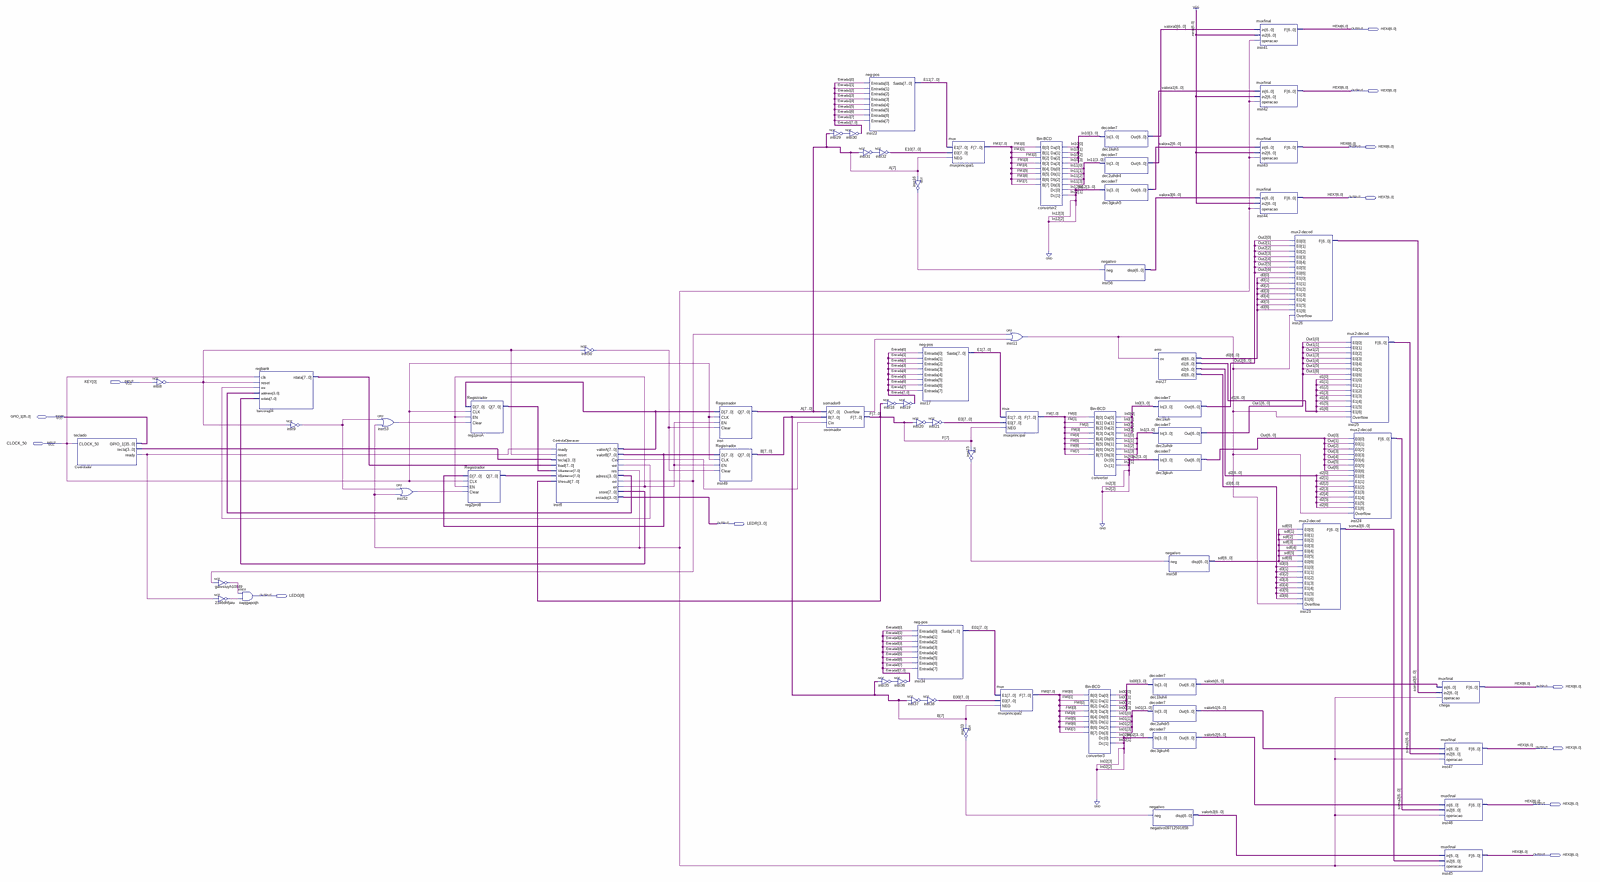
[diagram p0: schematic sheet, whole]
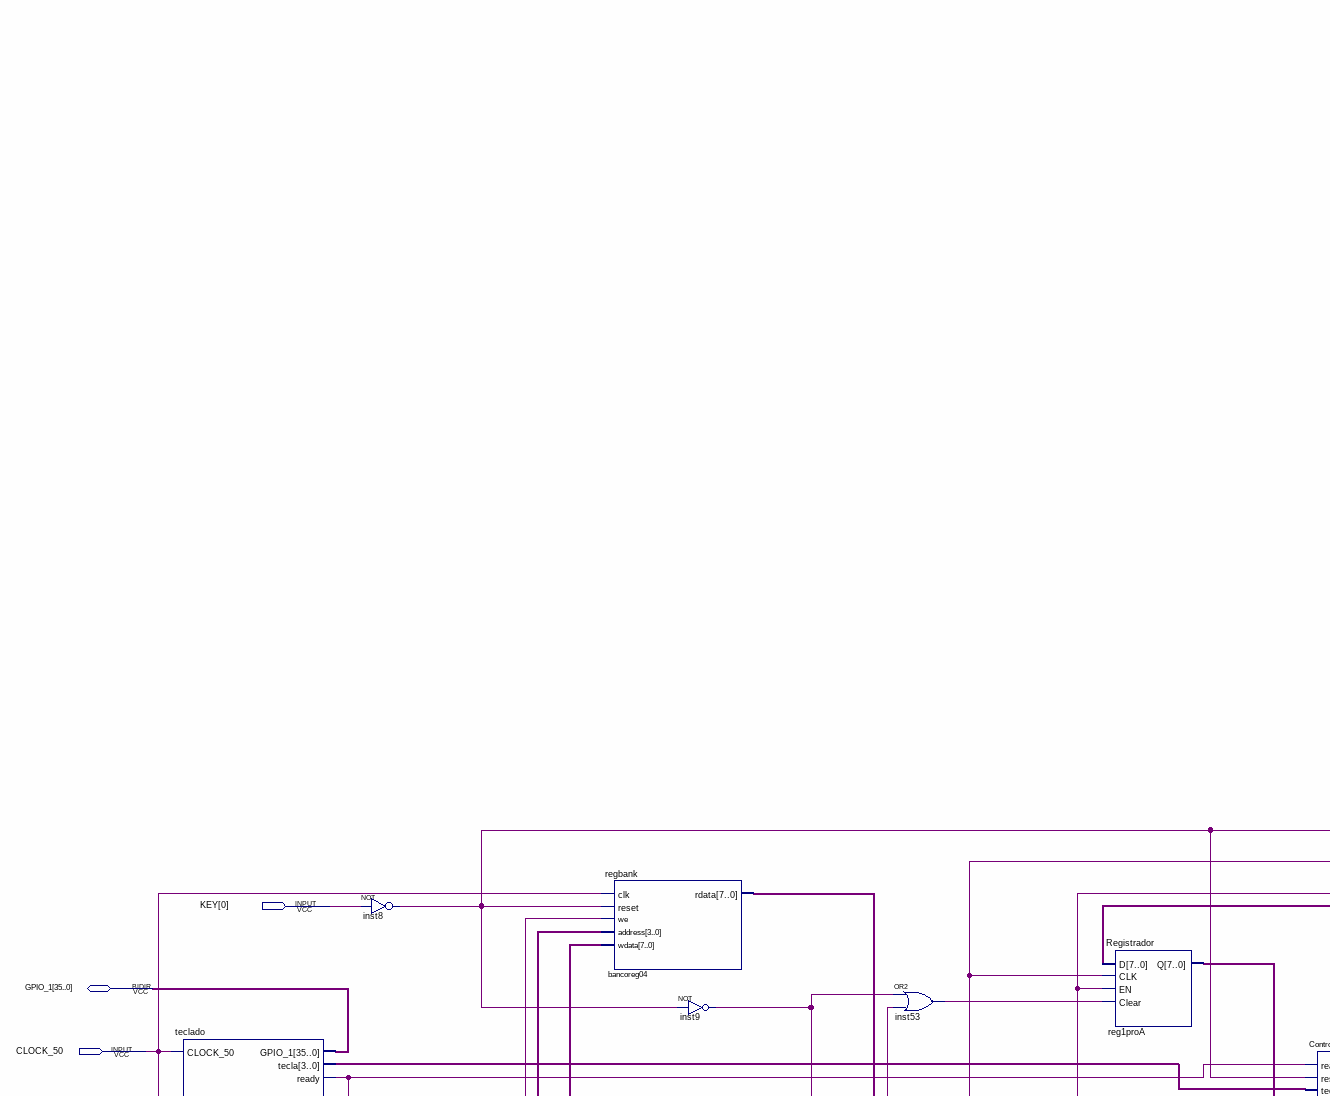
[diagram p1: schematic sheet, upper left part]
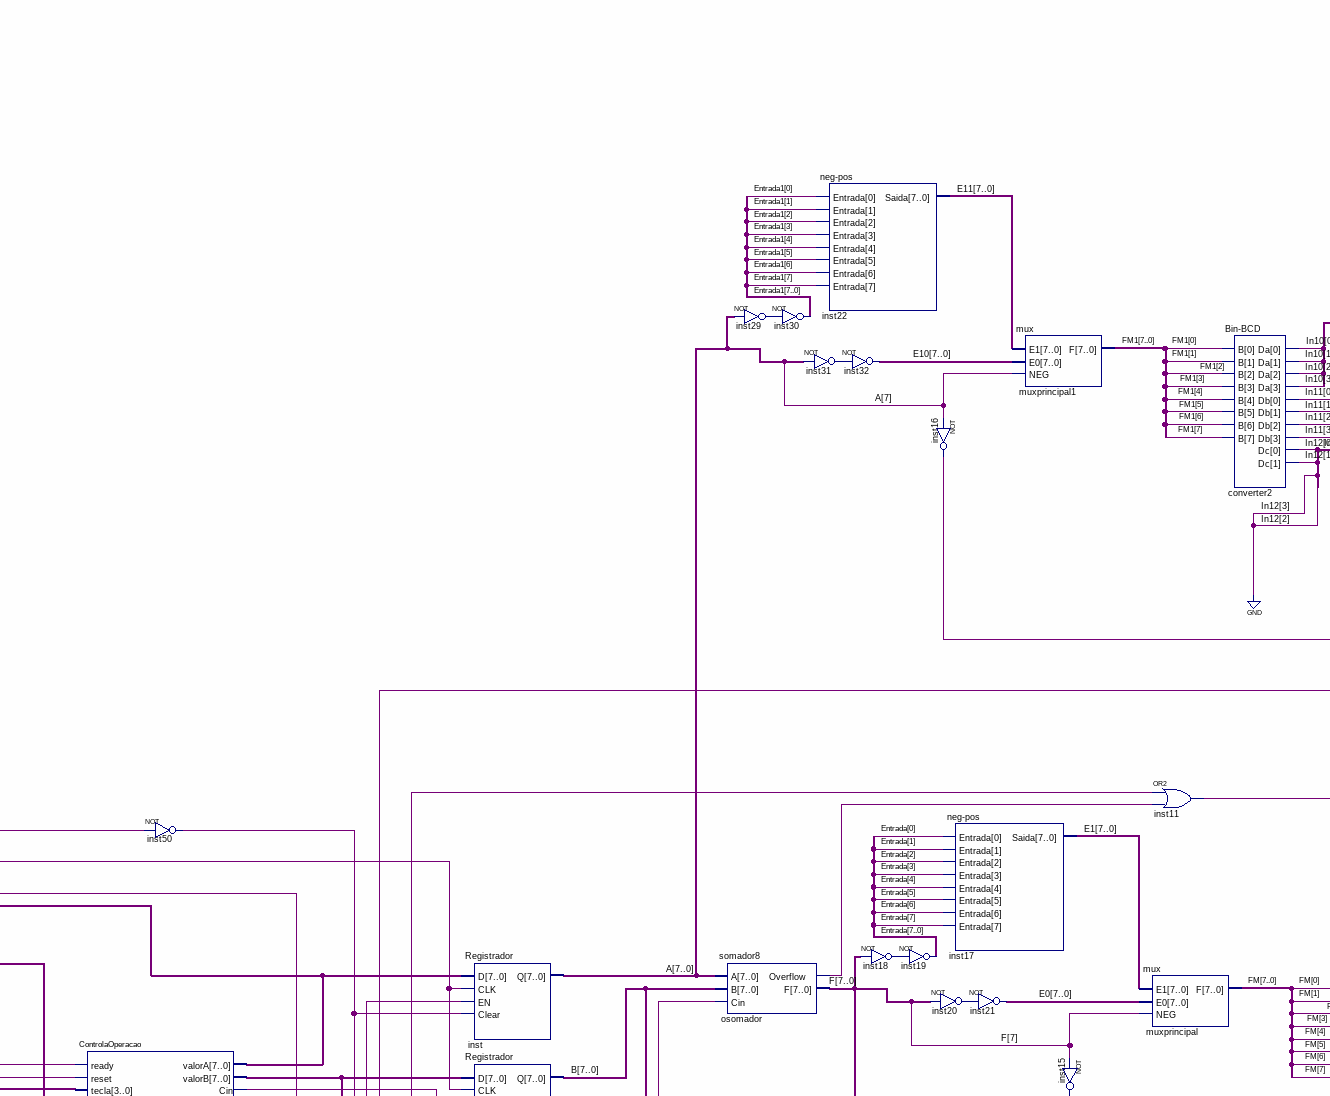
[diagram p2: schematic sheet, upper centre part]
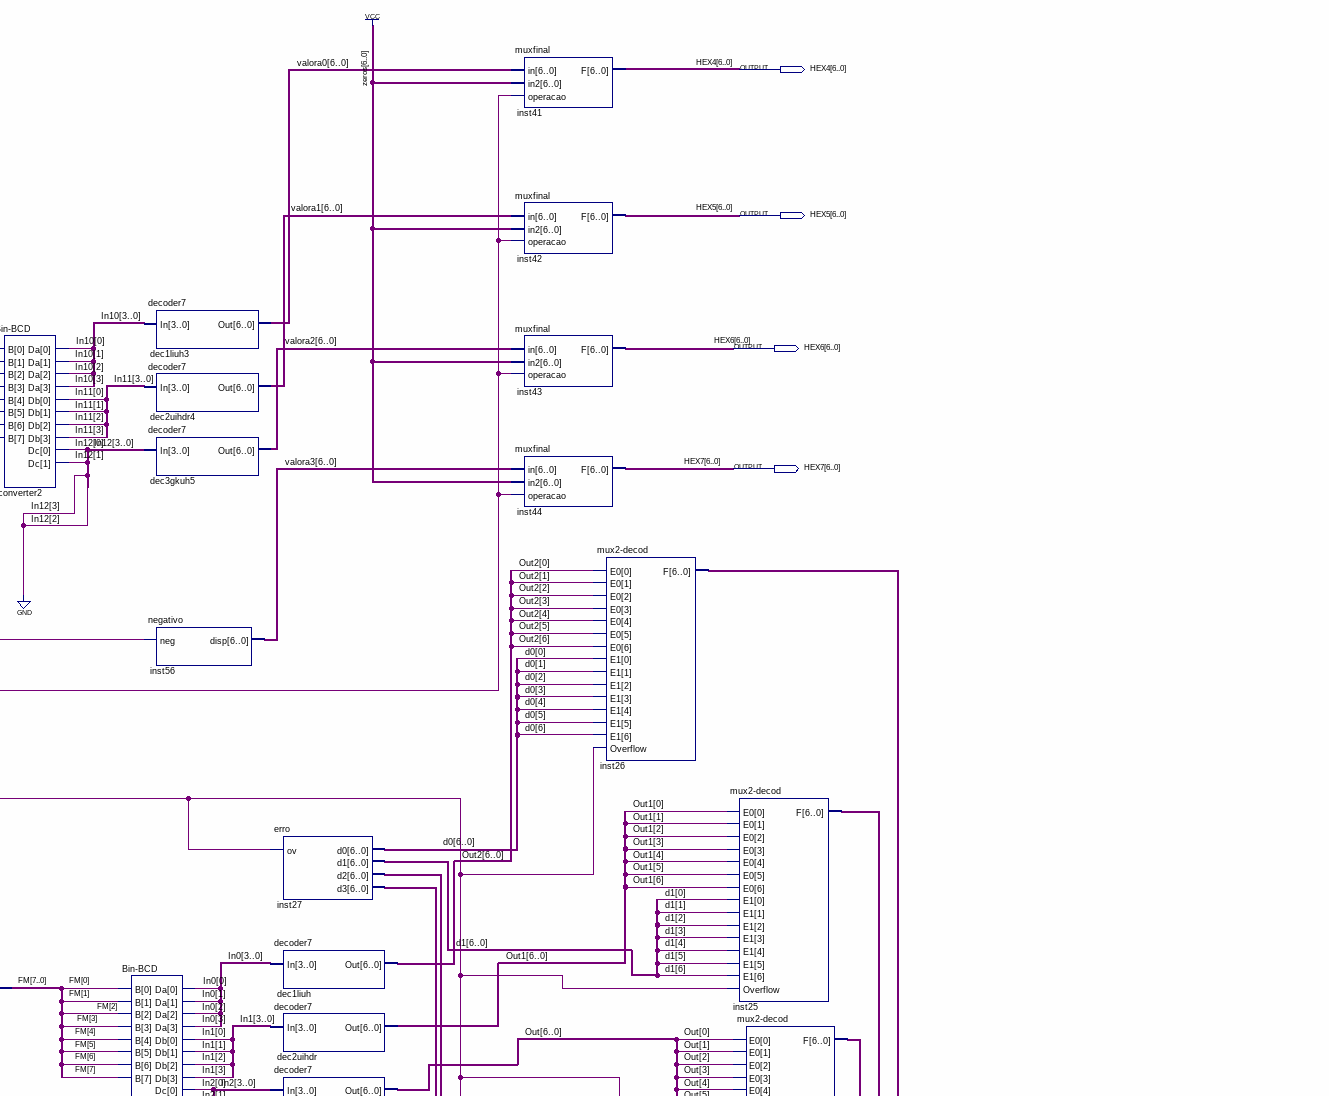
[diagram p3: schematic sheet, upper right part]
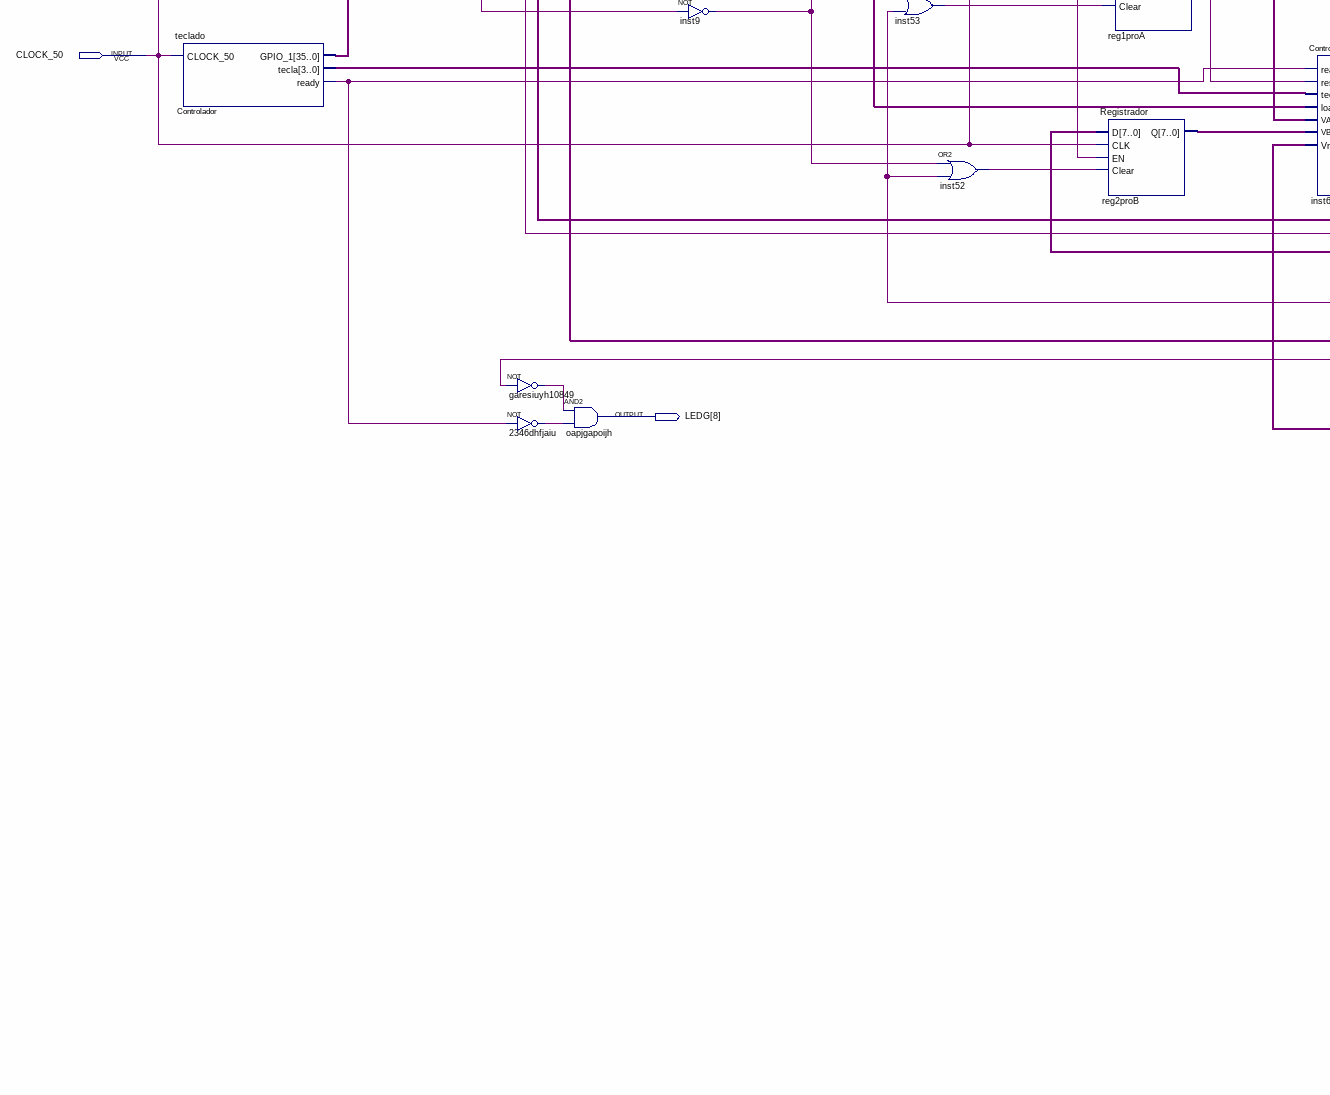
[diagram p4: schematic sheet, lower left part]
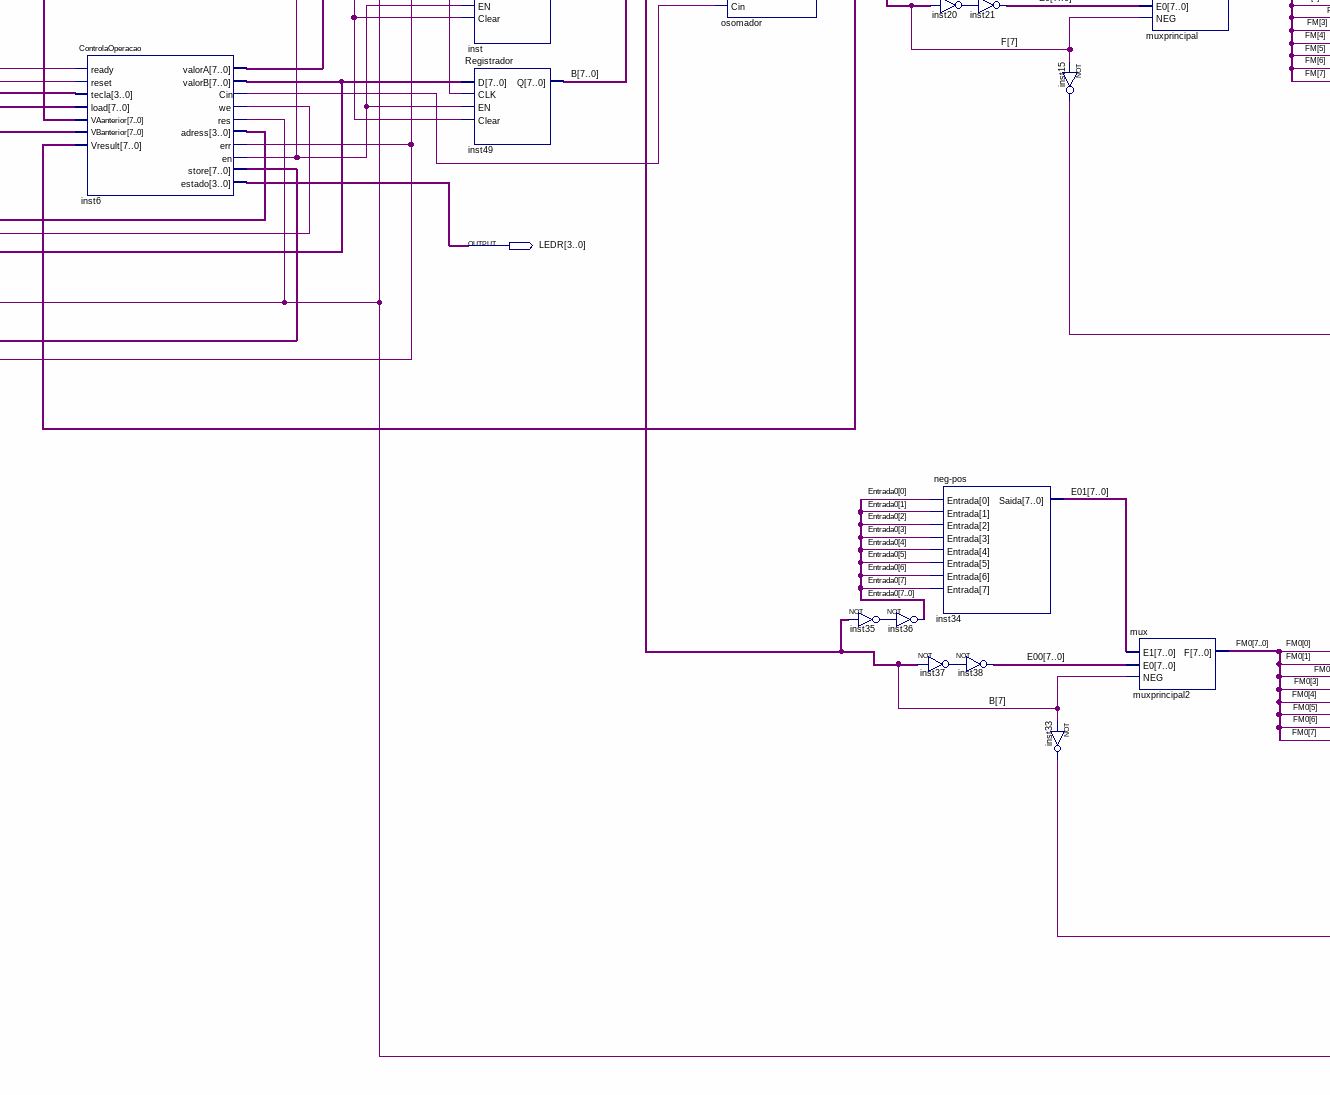
[diagram p5: schematic sheet, lower centre part]
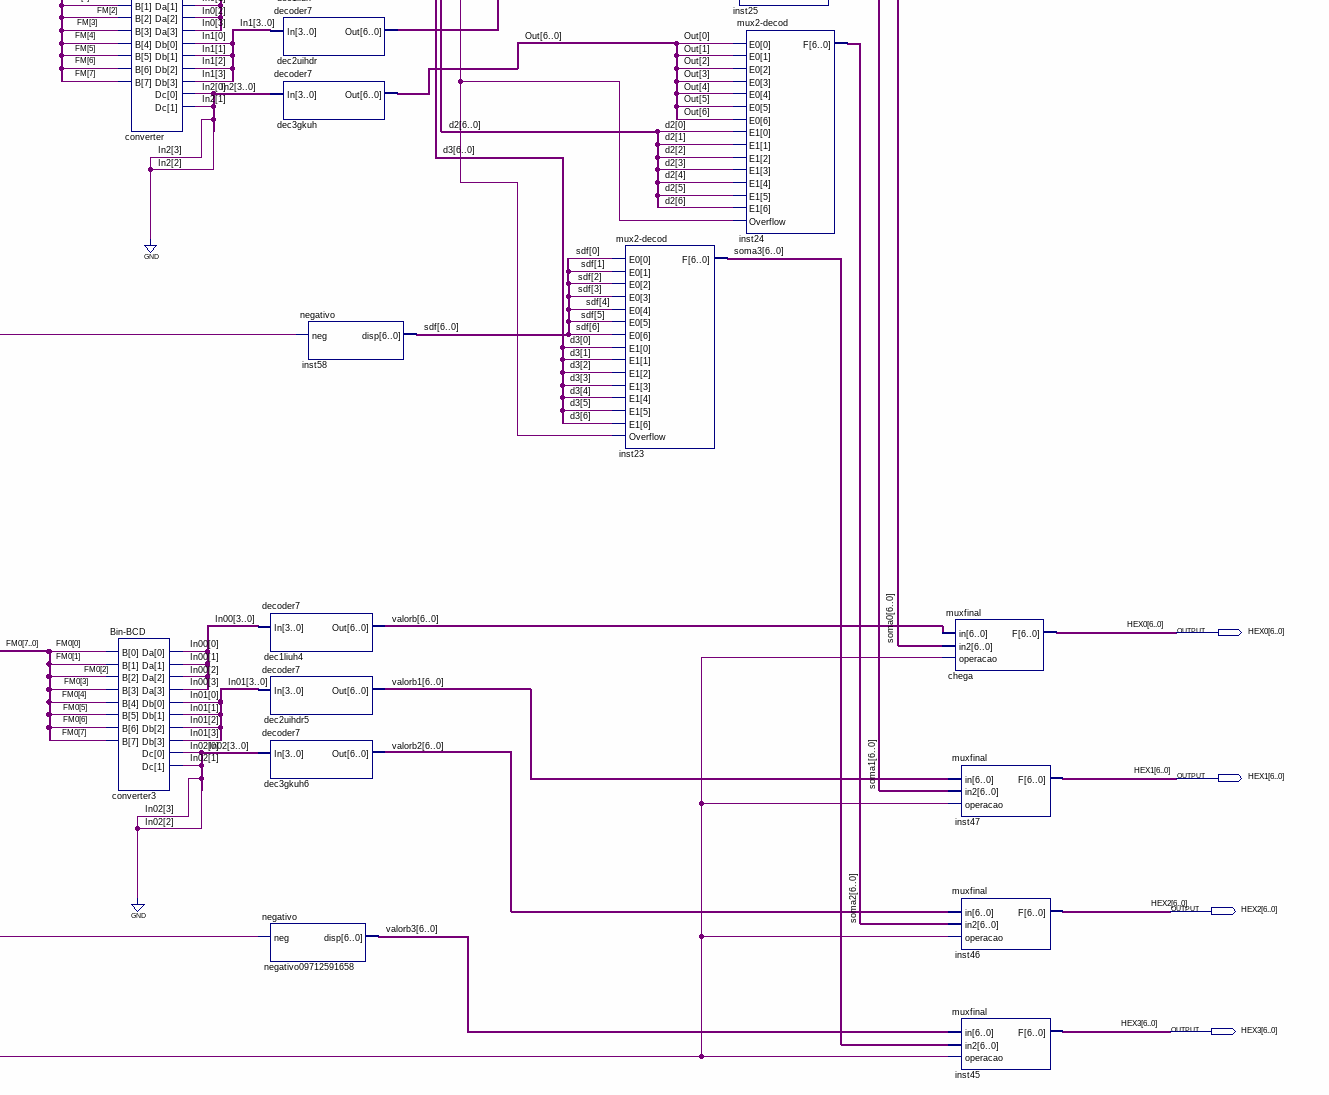
[diagram p6: schematic sheet, lower right part]
// Quartus schematic proj.bdf as structural Verilog: 66 symbols, 13 pins
module proj (
  input  [0:0] KEY,
  input  CLOCK_50,
  inout  [35:0] GPIO_1,
  output [6:0] HEX4,
  output [6:0] HEX5,
  output [6:0] HEX6,
  output [6:0] HEX7,
  output [3:0] LEDR,
  output [8:8] LEDG,
  output [6:0] HEX0,
  output [6:0] HEX1,
  output [6:0] HEX2,
  output [6:0] HEX3
);

  wire Controlador_ready, garesiuyh10849_out, inst6_cin, inst6_en, inst6_err, inst6_res, inst6_we, inst8_out,
       inst9_out, inst11_out, inst15_out, inst16_out, inst18_out, inst20_out, inst29_out, inst31_out,
       inst33_out, inst35_out, inst37_out, inst50_out, inst52_out, inst53_out, n2346dhfjaiu_out,
       osomador_overflow;
  wire [1:0] In02, In2, In12;
  wire [3:0] Controlador_tecla, In0, In00, In01, In1, In10, In11, inst6_adress;
  wire [6:0] d0, d1, d2, d3, Out, Out1, Out2, sdf, soma0, soma1, soma2, soma3, valora0, valora1, valora2,
       valora3, valorb, valorb1, valorb2, valorb3;
  wire [7:0] A, B, bancoreg04_rdata, E0, E00, E01, E1, E10, E11, Entrada, Entrada0, Entrada1, F, FM, FM0,
       FM1, inst6_store, inst6_valora, inst6_valorb, reg1proA_q, reg2proB_q;

  teclado Controlador (.CLOCK_50(CLOCK_50), .tecla(Controlador_tecla), .ready(Controlador_ready), .GPIO_1(GPIO_1));
  not inst8 (inst8_out, KEY[0]);
  not garesiuyh10849 (garesiuyh10849_out, inst6_err);
  not u_2346dhfjaiu (n2346dhfjaiu_out, Controlador_ready);
  and oapjgapoijh (LEDG[8], garesiuyh10849_out, n2346dhfjaiu_out);
  regbank bancoreg04 (
    .clk(CLOCK_50), .reset(inst8_out), .we(inst6_we), .address(inst6_adress), .wdata(inst6_store),
    .rdata(bancoreg04_rdata));
  not inst9 (inst9_out, inst8_out);
  or inst53 (inst53_out, inst9_out, inst6_res);
  or inst52 (inst52_out, inst9_out, inst6_res);
  Registrador reg1proA (.D(inst6_valora), .CLK(CLOCK_50), .EN(inst6_en), .Clear(inst53_out), .Q(reg1proA_q));
  Registrador reg2proB (.D(inst6_valorb), .CLK(CLOCK_50), .EN(inst6_en), .Clear(inst52_out), .Q(reg2proB_q));
  ControlaOperacao inst6 (
    .ready(Controlador_ready), .reset(inst8_out), .tecla(Controlador_tecla), .load(bancoreg04_rdata),
    .VAanterior(reg1proA_q), .VBanterior(reg2proB_q), .Vresult(F), .valorA(inst6_valora),
    .valorB(inst6_valorb), .Cin(inst6_cin), .we(inst6_we), .res(inst6_res), .adress(inst6_adress),
    .err(inst6_err), .en(inst6_en), .store(inst6_store), .estado(LEDR));
  not inst50 (inst50_out, inst8_out);
  Registrador inst (.D(inst6_valora), .CLK(CLOCK_50), .EN(inst6_en), .Clear(inst50_out), .Q(A));
  Registrador inst49 (.D(inst6_valorb), .CLK(CLOCK_50), .EN(inst6_en), .Clear(inst50_out), .Q(B));
  assign inst29_out = ~A;  // NOT inst29, 8 bits wide
  somador8 osomador (.A(A), .B(B), .Cin(inst6_cin), .Overflow(osomador_overflow), .F(F));
  assign Entrada1 = ~{8{inst29_out}};  // NOT inst30, 8 bits wide
  \neg-pos  inst22 (.Entrada(Entrada1), .Saida(E11));
  assign inst31_out = ~A;  // NOT inst31, 8 bits wide
  assign E10 = ~{8{inst31_out}};  // NOT inst32, 8 bits wide
  assign inst18_out = ~F;  // NOT inst18, 8 bits wide
  assign inst35_out = ~B;  // NOT inst35, 8 bits wide
  assign Entrada0 = ~{8{inst35_out}};  // NOT inst36, 8 bits wide
  not inst16 (inst16_out, A[7]);
  assign Entrada = ~{8{inst18_out}};  // NOT inst19, 8 bits wide
  assign inst20_out = ~F;  // NOT inst20, 8 bits wide
  \neg-pos  inst34 (.Entrada(Entrada0), .Saida(E01));
  assign inst37_out = ~B;  // NOT inst37, 8 bits wide
  \neg-pos  inst17 (.Entrada(Entrada), .Saida(E1));
  assign E0 = ~{8{inst20_out}};  // NOT inst21, 8 bits wide
  assign E00 = ~{8{inst37_out}};  // NOT inst38, 8 bits wide
  mux muxprincipal1 (.E1(E11), .E0(E10), .NEG(A[7]), .F(FM1));
  not inst15 (inst15_out, F[7]);
  not inst33 (inst33_out, B[7]);
  mux muxprincipal (.E1(E1), .E0(E0), .NEG(F[7]), .F(FM));
  mux muxprincipal2 (.E1(E01), .E0(E00), .NEG(B[7]), .F(FM0));
  or inst11 (inst11_out, inst6_err, osomador_overflow);
  \Bin-BCD  converter2 (.B(FM1), .Da(In10), .Db(In11), .Dc(In12));
  \Bin-BCD  converter3 (.B(FM0), .Da(In00), .Db(In01), .Dc(In02));
  decoder7 dec1liuh3 (.In(In10), .Out(valora0));
  decoder7 dec2uihdr4 (.In(In11), .Out(valora1));
  decoder7 dec3gkuh5 (.In({2'b00, In12}), .Out(valora2));
  negativo inst56 (.neg(inst16_out), .disp(valora3));
  \Bin-BCD  converter (.B(FM), .Da(In0), .Db(In1), .Dc(In2));
  decoder7 dec1liuh4 (.In(In00), .Out(valorb));
  decoder7 dec2uihdr5 (.In(In01), .Out(valorb1));
  decoder7 dec3gkuh6 (.In({2'b00, In02}), .Out(valorb2));
  negativo negativo09712591658 (.neg(inst33_out), .disp(valorb3));
  erro inst27 (.ov(inst11_out), .d0(d0), .d1(d1), .d2(d2), .d3(d3));
  decoder7 dec1liuh (.In(In0), .Out(Out2));
  decoder7 dec2uihdr (.In(In1), .Out(Out1));
  decoder7 dec3gkuh (.In({2'b00, In2}), .Out(Out));
  negativo inst58 (.neg(inst15_out), .disp(sdf));
  muxfinal inst41 (.in(valora0), .in2({7{1'b1}}), .operacao(inst6_res), .F(HEX4));
  muxfinal inst42 (.in(valora1), .in2({7{1'b1}}), .operacao(inst6_res), .F(HEX5));
  muxfinal inst43 (.in(valora2), .in2({7{1'b1}}), .operacao(inst6_res), .F(HEX6));
  muxfinal inst44 (.in(valora3), .in2({7{1'b1}}), .operacao(inst6_res), .F(HEX7));
  \mux2-decod  inst26 (.E0(Out2), .E1(d0), .Overflow(inst11_out), .F(soma0));
  \mux2-decod  inst23 (.E0(sdf), .E1(d3), .Overflow(inst11_out), .F(soma3));
  \mux2-decod  inst25 (.E0(Out1), .E1(d1), .Overflow(inst11_out), .F(soma1));
  \mux2-decod  inst24 (.E0(Out), .E1(d2), .Overflow(inst11_out), .F(soma2));
  muxfinal chega (.in(valorb), .in2(soma0), .operacao(inst6_res), .F(HEX0));
  muxfinal inst47 (.in(valorb1), .in2(soma1), .operacao(inst6_res), .F(HEX1));
  muxfinal inst46 (.in(valorb2), .in2(soma2), .operacao(inst6_res), .F(HEX2));
  muxfinal inst45 (.in(valorb3), .in2(soma3), .operacao(inst6_res), .F(HEX3));
endmodule
